# Altium schematic sheet ATmega_2560_Pro.SchDoc (part 4 of 4)
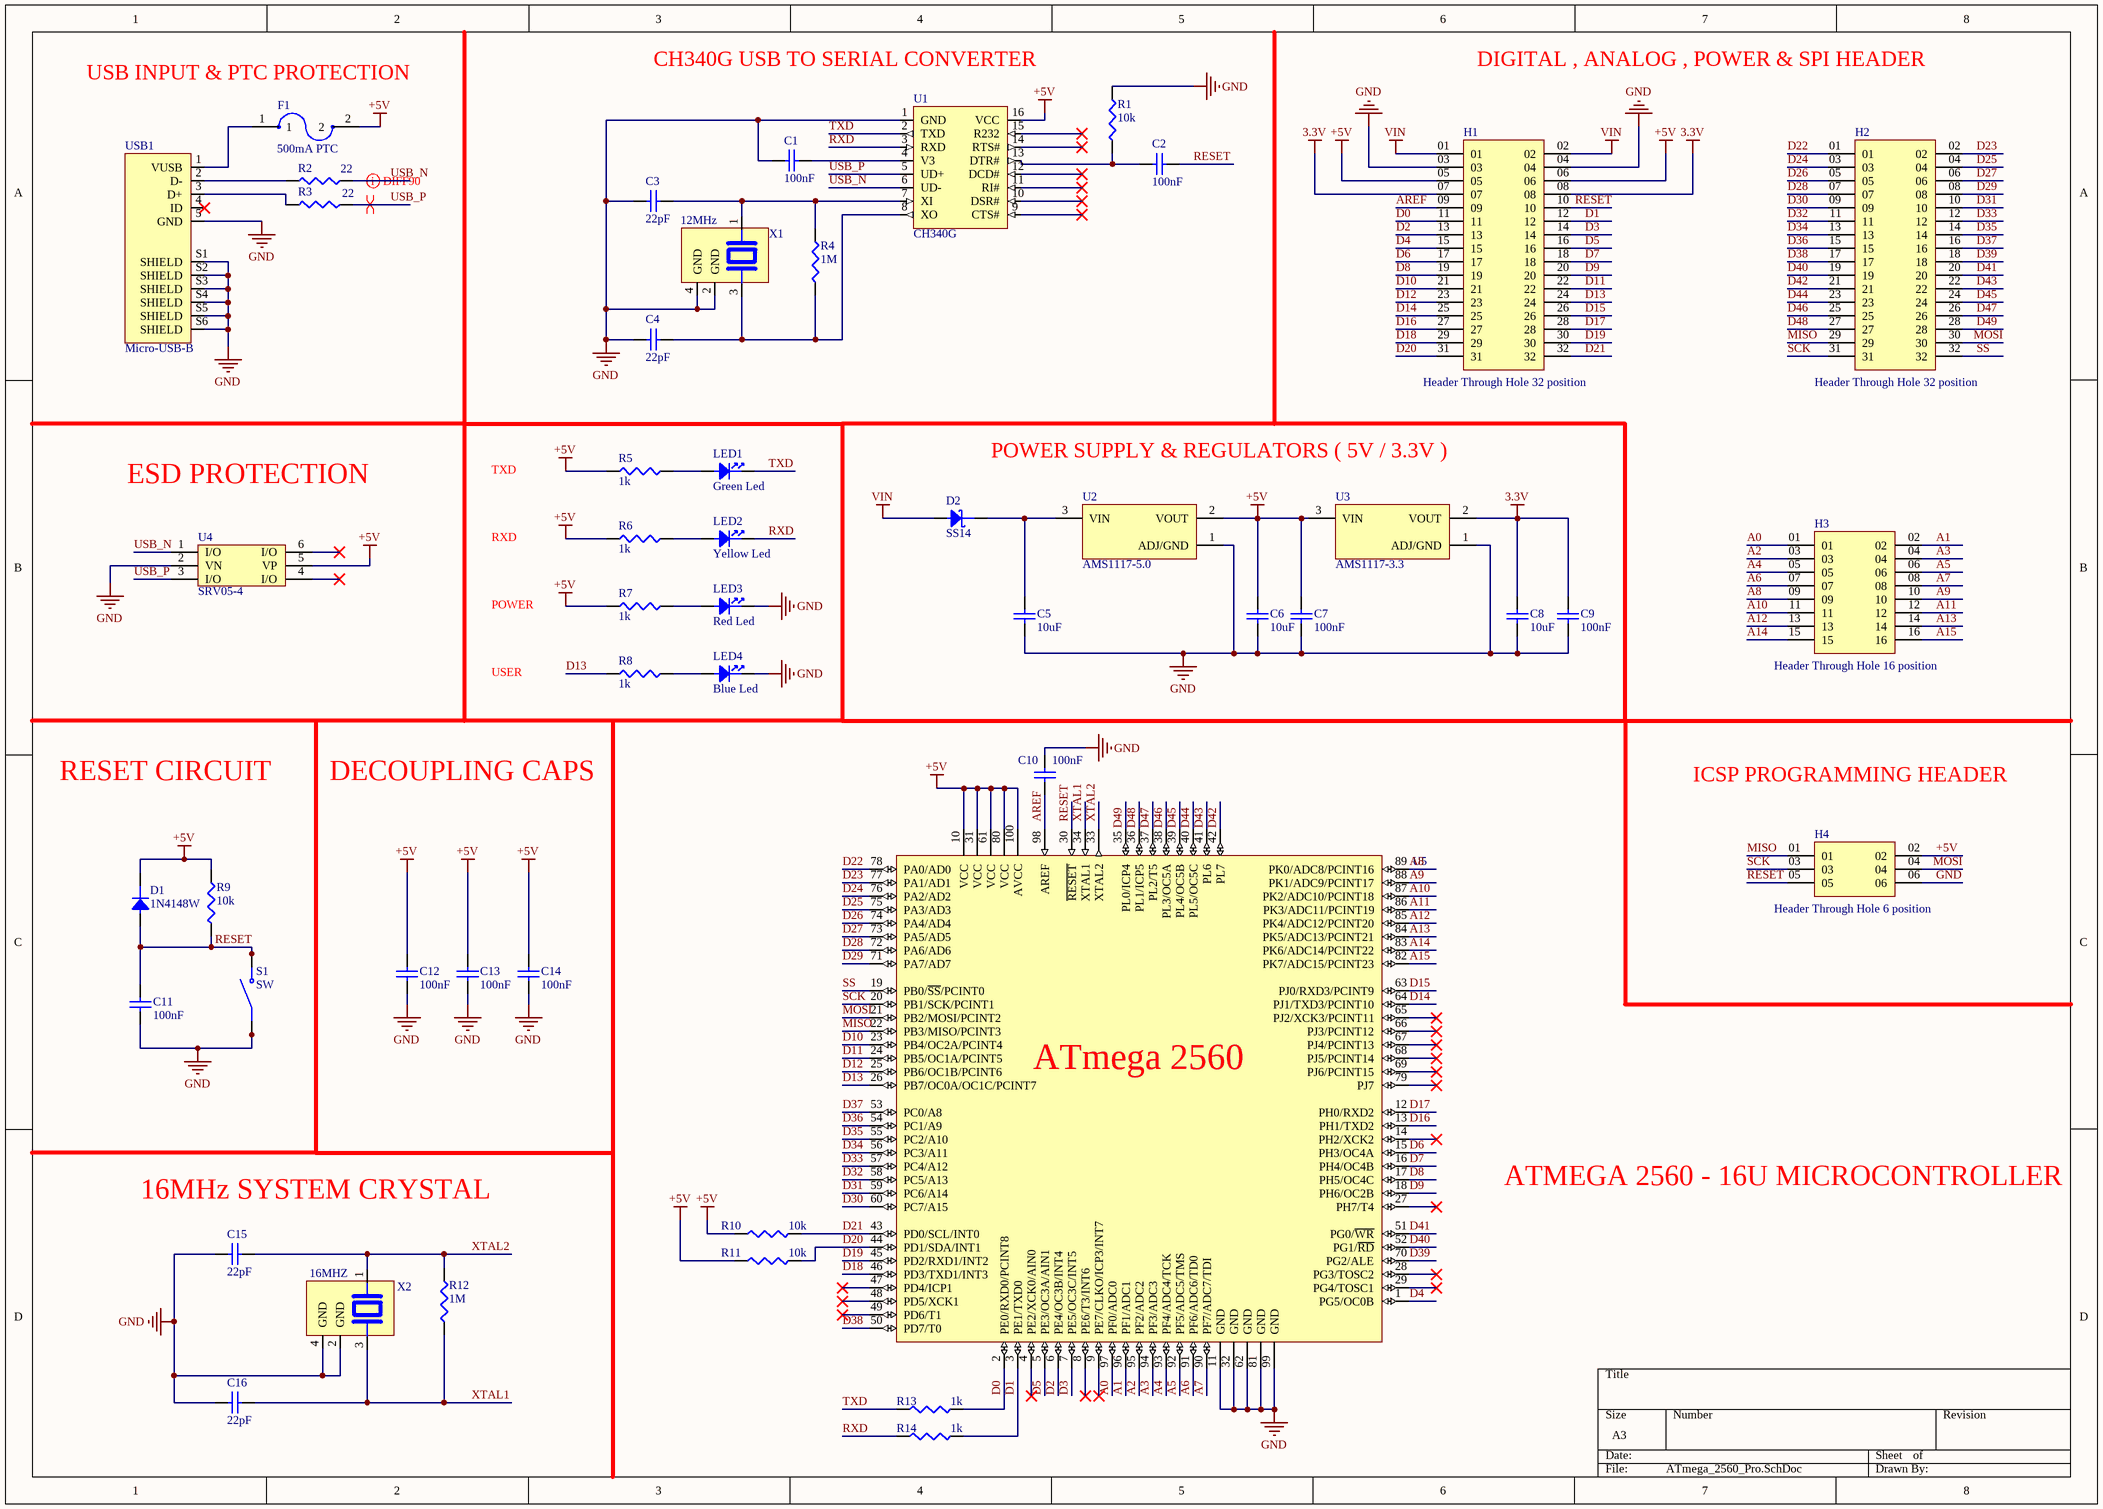
[diagram p3: ATmega_2560_Pro.SchDoc]

## Library data of the parts (continued)
U5 = ATMEGA2560-16AU: IC MCU 8BIT 256KB FLASH 100TQFP; Manufacturer: Microchip; Manufacturer Lifecycle Status: REL; Access Time: 16µs; Core Architecture: AVR; Data Bus Width: 8b; Density: 2Mb; Frequency: 16MHz; Interface: 2-Wire, I2C, SPI, USART; Max Supply Voltage: 5.5V; Min Supply Voltage: 4.5V; Number of A/D Converters: 1; Number of ADC Channels: 16; Number of I/Os: 86; Number of PWM Channels: 20; Number of SPI Channels: 5; Number of Timers/Counters: 6; Number of UART Channels: 4; Operating Supply Voltage: 5V; Oscillator Type: Internal; Peripherals: Brown-out Detect/Reset, POR, PWM, WDT; RAM Size: 8kB; Watchdog Timer: Yes; Supplier: DigiKey; Supplier Part Number: ATMEGA2560-16AU-ND; Manufacturer Part Number: ATMEGA2560-16AU; RoHS: Compliant; Category: Microcontrollers; Stock: 12847; Pricing: 1=18.11 (USD); Projected EOL Date: 2039-11-01; Case/Package: TQFP; Country of Assembly: Thailand; Country of Fabrication: United States of America; Country of Origin: Thailand; Export Control Classification Number (ECCN) Code: EAR99; Height: 1.2mm; HS Code: 8542.31.0015; Harmonized Tariff Schedule (HTS) Code: 8542.31.0015; Lead Free: Lead Free; Length: 14.1mm; Lifecycle Status: Production; Clock Frequency: 16MHz; Max Operating Temperature: 85°C; Memory Size: 256kB; Memory Format: FLASH; Min Operating Temperature: -40°C; Mounting Technology: Surface Mount; Number of I2C Channels: 1; Pins: 100; Number of Programmable I/O: 86; Number of Terminals: 100; Radiation Hardening: No; REACH SVHC: Unaffected; Schedule B: 8542310000, 8542310000|8542310000|8542310000|8542310000|8542310000; Termination: SMD/SMT; Width: 14.1mm; ComponentLink1URL: https://datasheet.octopart.com:443/ATMEGA2560-16AU-Microchip-datasheet-141243538.pdf?src-supplier=Microchip; ComponentLink1Description: https://datasheet.octopart.com:443/ATMEGA2560-16AU-Microchip-datasheet-141243538.pdf?src-supplier=Microchip; ComponentLink2URL: https://datasheet.octopart.com:443/ATMEGA2560-16AU-Microchip-datasheet-24967521.pdf?src-supplier=element14+APAC; ComponentLink2Description: https://datasheet.octopart.com:443/ATMEGA2560-16AU-Microchip-datasheet-24967521.pdf?src-supplier=element14+APAC; ComponentLink3URL: https://datasheet.octopart.com:443/ATMEGA2560-16AU-Microchip-datasheet-62057665.pdf?src-supplier=element14+APAC; ComponentLink3Description: https://datasheet.octopart.com:443/ATMEGA2560-16AU-Microchip-datasheet-62057665.pdf?src-supplier=element14+APAC; ComponentLink4URL: https://datasheet.octopart.com:443/ATMEGA2560-16AU-Microchip-datasheet-46907977.pdf?src-supplier=SHENGYU+ELECTRONICS; ComponentLink4Description: https://datasheet.octopart.com:443/ATMEGA2560-16AU-Microchip-datasheet-46907977.pdf?src-supplier=SHENGYU+ELECTRONICS; ComponentLink5URL: https://sigma.octopart.com:443/138797047/technical_drawing/Microchip-ATMEGA2560-16AU.pdf?src-supplier=Upverter; ComponentLink5Description: https://sigma.octopart.com:443/138797047/technical_drawing/Microchip-ATMEGA2560-16AU.pdf?src-supplier=Upverter; ComponentLink6URL: https://datasheet.octopart.com:443/ATMEGA2560-16AU-Microchip-datasheet-136948588.pdf?src-supplier=Master+Electronics; ComponentLink6Description: https://datasheet.octopart.com:443/ATMEGA2560-16AU-Microchip-datasheet-136948588.pdf?src-supplier=Master+Electronics; ComponentLink7URL: https://datasheet.octopart.com:443/ATMEGA2560-16AU-Atmel-datasheet-5357710.pdf?src-supplier=TME; ComponentLink7Description: https://datasheet.octopart.com:443/ATMEGA2560-16AU-Atmel-datasheet-5357710.pdf?src-supplier=TME; ComponentLink8URL: https://datasheet.octopart.com:443/ATMEGA2560-16AU-Microchip-datasheet-12542.pdf?src-supplier=element14; ComponentLink8Description: https://datasheet.octopart.com:443/ATMEGA2560-16AU-Microchip-datasheet-12542.pdf?src-supplier=element14; ComponentLink9URL: https://datasheet.octopart.com:443/ATMEGA2560-16AU-Atmel-datasheet-13399453.pdf?src-supplier=_legacy+Avnet; ComponentLink9Description: https://datasheet.octopart.com:443/ATMEGA2560-16AU-Atmel-datasheet-13399453.pdf?src-supplier=_legacy+Avnet; ComponentLink10URL: https://datasheet.octopart.com:443/ATMEGA2560-16AU-Microchip-datasheet-120916.pdf?src-supplier=RS+(Formerly+Allied+Electronics); ComponentLink10Description: https://datasheet.octopart.com:443/ATMEGA2560-16AU-Microchip-datasheet-120916.pdf?src-supplier=RS+(Formerly+Allied+Electronics); ComponentLink11URL: http://sigma.octopart.com:80/188449921/materials_sheet/Microchip-ATMEGA2560-16AU.pdf?src-supplier=Compliance+Statements; ComponentLink11Description: http://sigma.octopart.com:80/188449921/materials_sheet/Microchip-ATMEGA2560-16AU.pdf?src-supplier=Compliance+Statements; ComponentLink12URL: http://sigma.octopart.com:80/rohs_statement/Microchip-company-71.pdf?src-supplier=Compliance+Statements; ComponentLink12Description: http://sigma.octopart.com:80/rohs_statement/Microchip-company-71.pdf?src-supplier=Compliance+Statements; ComponentLink13URL: http://sigma.octopart.com:80/reach_statement/Microchip-company-70.pdf?src-supplier=Compliance+Statements; ComponentLink13Description: http://sigma.octopart.com:80/reach_statement/Microchip-company-70.pdf?src-supplier=Compliance+Statements; ComponentLink14URL: http://sigma.octopart.com:80/conflict_mineral_statement/Microchip-company-69.pdf?src-supplier=Compliance+Statements; ComponentLink14Description: http://sigma.octopart.com:80/conflict_mineral_statement/Microchip-company-69.pdf?src-supplier=Compliance+Statements; ComponentLink15URL: http://sigma.octopart.com:80/conflict_mineral_statement/Microchip-company-68.pdf?src-supplier=Compliance+Statements; ComponentLink15Description: http://sigma.octopart.com:80/conflict_mineral_statement/Microchip-company-68.pdf?src-supplier=Compliance+Statements; ComponentLink16URL: http://sigma.octopart.com:80/reach_statement/Atmel-company-6.pdf?src-supplier=Compliance+Statements; ComponentLink16Description: http://sigma.octopart.com:80/reach_statement/Atmel-company-6.pdf?src-supplier=Compliance+Statements; ComponentLink17URL: http://sigma.octopart.com:80/rohs_statement/Atmel-company-5.pdf?src-supplier=Compliance+Statements; ComponentLink17Description: http://sigma.octopart.com:80/rohs_statement/Atmel-company-5.pdf?src-supplier=Compliance+Statements; ComponentLink18URL: http://sigma.octopart.com:80/rohs_statement/Atmel-company-4.pdf?src-supplier=Compliance+Statements; ComponentLink18Description: http://sigma.octopart.com:80/rohs_statement/Atmel-company-4.pdf?src-supplier=Compliance+Statements
USB1 = 10118193-0001LF: CONN RCPT USB2.0 MICRO B SMD R/A; Manufacturer: Amphenol Communications Solutions; Connector Type: Receptacle, USB; Contact Resistance: 30mΩ; Current Rating: 1.8A; Dielectric Material: Liquid Crystal Polymer; Gender: Female; Insulation Resistance: 1GΩ; Max Voltage Rating (AC): 100V; Number of Contacts: 5; Number of Ports: 1; Operating Force: 35.1392N; Pitch: 650µm; Plating Thickness: 762nm; Supplier: DigiKey; Supplier Part Number: 609-4616-1-ND; Manufacturer Part Number: 10118193-0001LF; RoHS: Compliant; Category: USB Connectors; Stock: 63727; Pricing: 1=0.5, 10=0.422, 25=0.3952, 50=0.3762, 100=0.3583, 250=0.3358, 500=0.31976 (USD); China RoHS: Compliant; Color: Black; Contact Material: Gold, Nickel; Contact Plating: Gold; Depth: 5.67mm; Features: Shielded; Flammability Rating: UL94 V-0; Height: 3mm; Housing Material: Polymer; Length: 7.86mm; Lifecycle Status: Production; Max Operating Temperature: 80°C; Min Operating Temperature: -55°C; Mounting Technology: Horizontal, Surface Mount; Pins: 11; Number of Positions: 5; Number of Rows: 1; Number of Terminals: 5; Orientation: Right Angle; Radiation Hardening: No; REACH SVHC: Unaffected; Shell Material: Stainless Steel; Terminal Pitch: 660.4µm; Termination: Solder; USB Standard: USB 2.0; Voltage Rating: 100V; ComponentLink1URL: https://datasheet.octopart.com:443/10118193-0001LF-Amphenol-Communications-Solutions-datasheet-182239125.pdf?src-supplier=IHS; ComponentLink1Description: https://datasheet.octopart.com:443/10118193-0001LF-Amphenol-Communications-Solutions-datasheet-182239125.pdf?src-supplier=IHS; ComponentLink2URL: https://datasheet.octopart.com:443/10118193-0001LF-Amphenol-Communications-Solutions-datasheet-55953155.pdf?src-supplier=TME; ComponentLink2Description: https://datasheet.octopart.com:443/10118193-0001LF-Amphenol-Communications-Solutions-datasheet-55953155.pdf?src-supplier=TME; ComponentLink3URL: https://datasheet.octopart.com:443/10118193-0001LF-Amphenol-ICC-datasheet-116246833.pdf?src-supplier=Upverter; ComponentLink3Description: https://datasheet.octopart.com:443/10118193-0001LF-Amphenol-ICC-datasheet-116246833.pdf?src-supplier=Upverter; ComponentLink4URL: https://datasheet.octopart.com:443/10118193-0001LF-FCI-datasheet-141913714.pdf?src-supplier=Upverter; ComponentLink4Description: https://datasheet.octopart.com:443/10118193-0001LF-FCI-datasheet-141913714.pdf?src-supplier=Upverter; ComponentLink5URL: https://datasheet.octopart.com:443/10118193-0001LF-Amphenol-Communications-Solutions-datasheet-96019471.pdf?src-supplier=element14+APAC; ComponentLink5Description: https://datasheet.octopart.com:443/10118193-0001LF-Amphenol-Communications-Solutions-datasheet-96019471.pdf?src-supplier=element14+APAC; ComponentLink6URL: https://datasheet.octopart.com:443/10118193-0001LF-Amphenol-Communications-Solutions-datasheet-11792339.pdf?src-supplier=Electro+Sonic; ComponentLink6Description: https://datasheet.octopart.com:443/10118193-0001LF-Amphenol-Communications-Solutions-datasheet-11792339.pdf?src-supplier=Electro+Sonic; ComponentLink7URL: https://datasheet.octopart.com:443/10118193-0001LF-Amphenol-Communications-Solutions-datasheet-13702206.pdf?src-supplier=RS+(Formerly+Allied+Electronics); ComponentLink7Description: https://datasheet.octopart.com:443/10118193-0001LF-Amphenol-Communications-Solutions-datasheet-13702206.pdf?src-supplier=RS+(Formerly+Allied+Electronics)
X1 = 7M-12.000MAAJ-T: CRYSTAL 12.0000MHZ 18PF SMD; Manufacturer 1: TXC; ESR (Equivalent Series Resistance): 80Ω; Frequency Stability: 30ppm; Frequency Tolerance: 0.003%; Supplier 1: DigiKey; Manufacturer Part Number 1: 7M-12.000MAAJ-T; Stock 1: 8397; Pricing 1: 3000=0.54592, 6000=0.52337, 9000=0.51063, 15000=0.49502 (USD); RoHS: Compliant; Case/Package: SMD/SMT; China RoHS: Compliant; Country of Origin: Mainland China; Depth: 2.5mm; Frequency: 12MHz; Height: 800µm; Harmonized Tariff Schedule (HTS) Code: 8541.60.00.50; Introduction Date: 2009-02-20; Lead Free: Lead Free; Length: 3.2mm; Lifecycle Status: Production; Load Capacitance: 18pF; Max Operating Temperature: 70°C; Min Operating Temperature: -20°C; Mounting Technology: Surface Mount; Pins: 4; Packaging: Tape & Reel; REACH SVHC: Unaffected; Schedule B: 8541600080, 8541600080|8541600080|8541600080|8541600080|8541600080; ESR: 80Ω; Termination: SMD/SMT; Tolerance: 0.003%; Width: 2.4892mm; ComponentLink1URL: https://datasheet.octopart.com:443/7M-12.000MAAJ-T-TXC-datasheet-175949319.pdf?src-supplier=Newark; ComponentLink1Description: https://datasheet.octopart.com:443/7M-12.000MAAJ-T-TXC-datasheet-175949319.pdf?src-supplier=Newark; ComponentLink2URL: https://datasheet.octopart.com:443/7M-12.000MAAJ-T-TXC-datasheet-142346318.pdf?src-supplier=TME; ComponentLink2Description: https://datasheet.octopart.com:443/7M-12.000MAAJ-T-TXC-datasheet-142346318.pdf?src-supplier=TME; ComponentLink3URL: https://datasheet.octopart.com:443/7M-12.000MAAJ-T-TXC-datasheet-24897103.pdf?src-supplier=ODG+(Origin+Data+Global); ComponentLink3Description: https://datasheet.octopart.com:443/7M-12.000MAAJ-T-TXC-datasheet-24897103.pdf?src-supplier=ODG+(Origin+Data+Global); ComponentLink4URL: https://datasheet.octopart.com:443/7M-12.000MAAJ-T-TXC-datasheet-10340792.pdf?src-supplier=element14+APAC; ComponentLink4Description: https://datasheet.octopart.com:443/7M-12.000MAAJ-T-TXC-datasheet-10340792.pdf?src-supplier=element14+APAC; ComponentLink5URL: https://datasheet.octopart.com:443/7M-12.000MAAJ-T-TXC-datasheet-15207195.pdf?src-supplier=element14+APAC; ComponentLink5Description: https://datasheet.octopart.com:443/7M-12.000MAAJ-T-TXC-datasheet-15207195.pdf?src-supplier=element14+APAC; ComponentLink6URL: https://datasheet.octopart.com:443/7M-12.000MAAJ-T-TXC-datasheet-8857452.pdf?src-supplier=Farnell; ComponentLink6Description: https://datasheet.octopart.com:443/7M-12.000MAAJ-T-TXC-datasheet-8857452.pdf?src-supplier=Farnell; ComponentLink7URL: https://datasheet.octopart.com:443/7M-12.000MAAJ-T-TXC-datasheet-10545748.pdf?src-supplier=Farnell; ComponentLink7Description: https://datasheet.octopart.com:443/7M-12.000MAAJ-T-TXC-datasheet-10545748.pdf?src-supplier=Farnell; ComponentLink8URL: https://datasheet.octopart.com:443/7M-12.000MAAJ-T-TXC-datasheet-10379982.pdf?src-supplier=Farnell; ComponentLink8Description: https://datasheet.octopart.com:443/7M-12.000MAAJ-T-TXC-datasheet-10379982.pdf?src-supplier=Farnell; Supplier Part Number 1: 887-1121-2-ND
X2 = 7M-16.000MAAJ-T: CRYSTAL 16.0000MHZ 18PF SMD; Manufacturer 1: TXC; ESR (Equivalent Series Resistance): 60Ω; Frequency Stability: 30ppm; Frequency Tolerance: 0.003%; Supplier 1: DigiKey; Manufacturer Part Number 1: 7M-16.000MAAJ-T; Stock 1: 43226; Pricing 1: 1=0.64, 10=0.553, 25=0.5228, 50=0.501, 100=0.4803, 250=0.45424, 500=0.43544, 1000=0.41743 (USD); RoHS: Compliant; Case/Package: SMD/SMT; China RoHS: Compliant; Country of Origin: Mainland China; Depth: 2.5mm; Frequency: 16MHz; Height: 800µm; Introduction Date: 2014-01-27; Length: 3.2mm; Lifecycle Status: Production; Load Capacitance: 18pF; Max Operating Temperature: 70°C; Min Operating Temperature: -20°C; Mounting Technology: Surface Mount; Pins: 4; Packaging: Tape & Reel; REACH SVHC: Unaffected; Schedule B: 8541600080, 8541600080|8541600080|8541600080|8541600080|8541600080; ESR: 60Ω; Termination: SMD/SMT; Tolerance: 0.003%; Width: 2.5mm; ComponentLink1URL: https://datasheet.octopart.com:443/7M-16.000MAAJ-T-TXC-datasheet-175949319.pdf?src-supplier=Newark; ComponentLink1Description: https://datasheet.octopart.com:443/7M-16.000MAAJ-T-TXC-datasheet-175949319.pdf?src-supplier=Newark; ComponentLink2URL: https://datasheet.octopart.com:443/7M-16.000MAAJ-T-TXC-datasheet-142346318.pdf?src-supplier=TME; ComponentLink2Description: https://datasheet.octopart.com:443/7M-16.000MAAJ-T-TXC-datasheet-142346318.pdf?src-supplier=TME; ComponentLink3URL: https://datasheet.octopart.com:443/7M-16.000MAAJ-T-TXC-datasheet-24897103.pdf?src-supplier=element14+APAC; ComponentLink3Description: https://datasheet.octopart.com:443/7M-16.000MAAJ-T-TXC-datasheet-24897103.pdf?src-supplier=element14+APAC; ComponentLink4URL: https://datasheet.octopart.com:443/7M-16.000MAAJ-T-TXC-datasheet-10340792.pdf?src-supplier=Future+Electronics; ComponentLink4Description: https://datasheet.octopart.com:443/7M-16.000MAAJ-T-TXC-datasheet-10340792.pdf?src-supplier=Future+Electronics; ComponentLink5URL: https://datasheet.octopart.com:443/7M-16.000MAAJ-T-TXC-datasheet-8857452.pdf?src-supplier=Farnell; ComponentLink5Description: https://datasheet.octopart.com:443/7M-16.000MAAJ-T-TXC-datasheet-8857452.pdf?src-supplier=Farnell; ComponentLink6URL: https://datasheet.octopart.com:443/7M-16.000MAAJ-T-TXC-datasheet-10545748.pdf?src-supplier=Farnell; ComponentLink6Description: https://datasheet.octopart.com:443/7M-16.000MAAJ-T-TXC-datasheet-10545748.pdf?src-supplier=Farnell; ComponentLink7URL: https://datasheet.octopart.com:443/7M-16.000MAAJ-T-TXC-datasheet-10379982.pdf?src-supplier=Farnell; ComponentLink7Description: https://datasheet.octopart.com:443/7M-16.000MAAJ-T-TXC-datasheet-10379982.pdf?src-supplier=Farnell; Supplier Part Number 1: 887-1125-1-ND